# EasyEDA schematic design.json
TITLE: Bin -> Onboard Jam!; REV: 1.0; Date: 2024-06-06; Sheet: 1/1; Drawn By: Evan; Company: Hack Club!
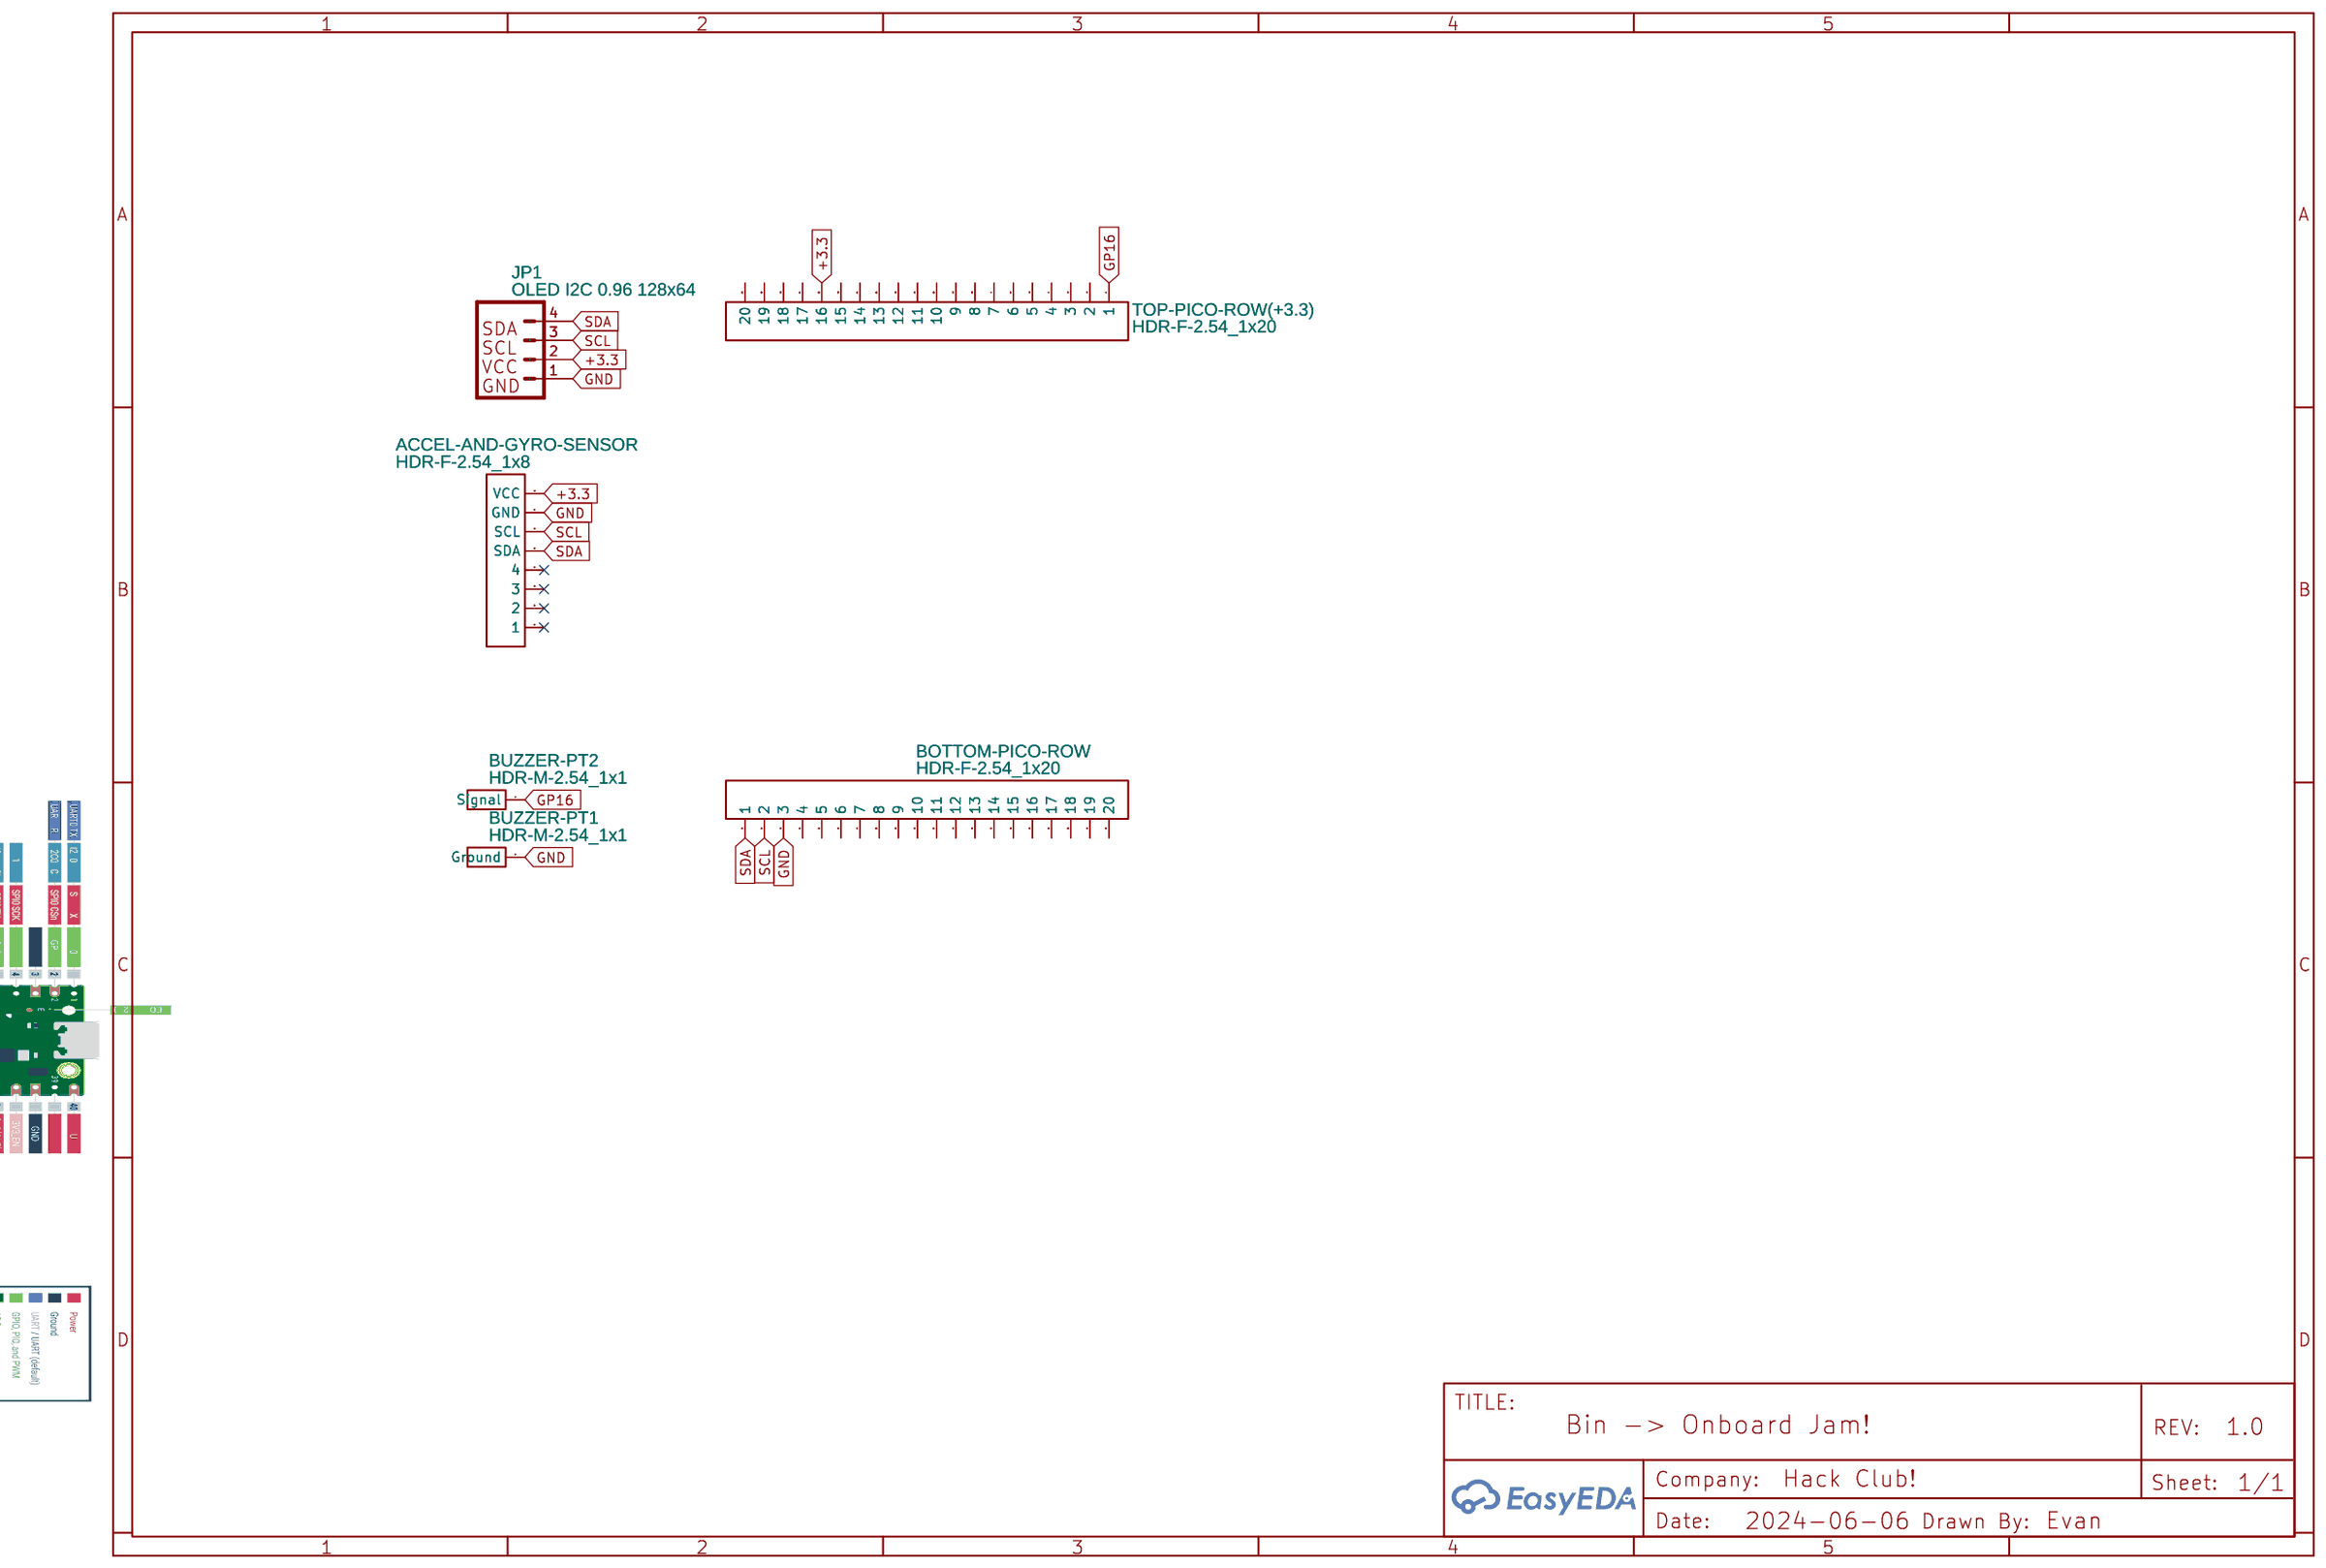
[diagram p0: schematic sheet]

## Parts
ACCEL-AND-GYRO-SENSOR  HDR-F-2.54_1x8  [HDR-F-2.54_1X8]
BOTTOM-PICO-ROW  HDR-F-2.54_1x20  [HDR-F-2.54_1X20]
BUZZER-PT1  HDR-M-2.54_1x1  [HDR-M-2.54_1X1]
BUZZER-PT2  HDR-M-2.54_1x1  [HDR-M-2.54_1X1]
JP1  OLED I2C 0.96 128x64  [OLED I2C 0.96 128X64]
TOP-PICO-ROW(+3.3)  HDR-F-2.54_1x20  [HDR-F-2.54_1X20]

## Library data of the parts
ACCEL-AND-GYRO-SENSOR = HDR-F-2.54_1x8: Supplier Part: C225505; Supplier: LCSC; Contributor: LCEDA_Lib
BOTTOM-PICO-ROW TOP-PICO-ROW(+3.3) = HDR-F-2.54_1x20: Supplier Part: C50984; Supplier: LCSC; Contributor: LCEDA_Lib
BUZZER-PT1 BUZZER-PT2 = HDR-M-2.54_1x1: Supplier Part: C81276; Supplier: LCSC; Contributor: LCEDA_Lib
JP1 = OLED I2C 0.96 128x64: SparkFun has standardized on a pinout for all I2C based sensor breakouts.; Contributor: SparkFun

## Nets
GND: ACCEL-AND-GYRO-SENSOR.7(GND) BOTTOM-PICO-ROW.3 BUZZER-PT1.1(Ground) JP1.1
+3.3: ACCEL-AND-GYRO-SENSOR.8(VCC) JP1.2 TOP-PICO-ROW(+3.3).16
GP16: BUZZER-PT2.1(Signal) TOP-PICO-ROW(+3.3).1
SCL: ACCEL-AND-GYRO-SENSOR.6(SCL) BOTTOM-PICO-ROW.2 JP1.3
SDA: ACCEL-AND-GYRO-SENSOR.5(SDA) BOTTOM-PICO-ROW.1 JP1.4

Not connected (* = marked no-connect by the designer): ACCEL-AND-GYRO-SENSOR 1* 2* 3* 4*; BOTTOM-PICO-ROW 4 5 6 7 8 9 10 11 12 13 14 15 16 17 18 19 20; TOP-PICO-ROW(+3.3) 2 3 4 5 6 7 8 9 10 11 12 13 14 15 17 18 19 20
